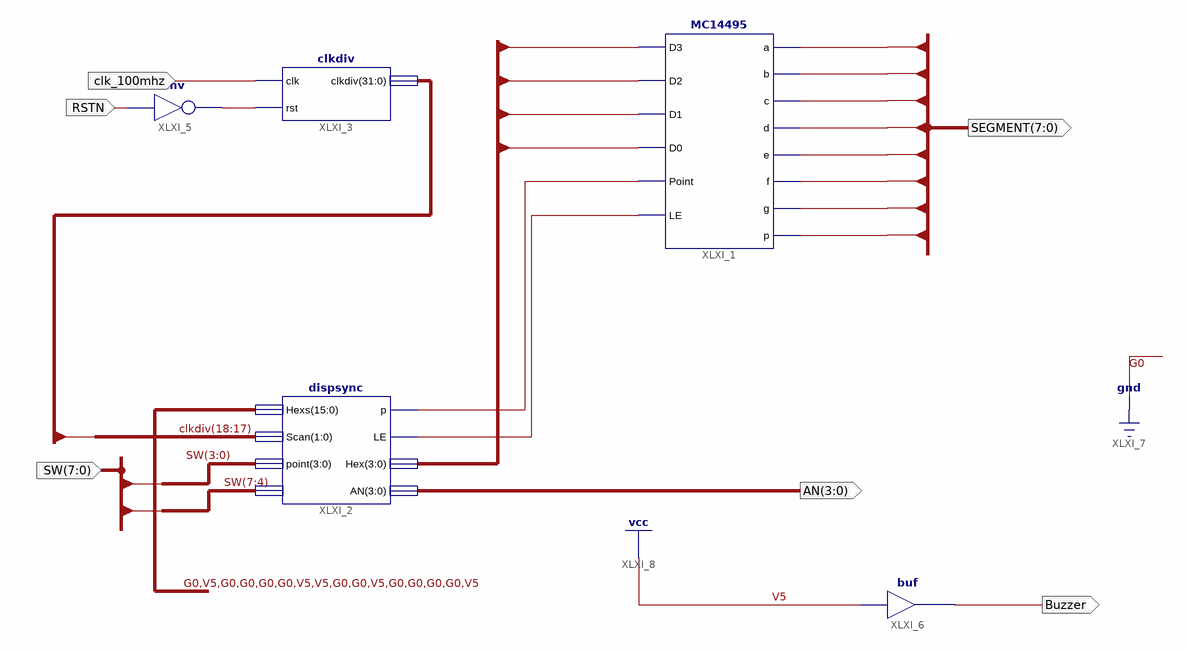
[diagram p0: schematic sheet 1]
// Xilinx ISE schematic Hex427Seg_sch.sch (kintex7) as structural Verilog: 5 symbols, 6 ports
module Hex427Seg_sch (
  input  [7:0] SW,
  input  clk_100mhz,
  input  RSTN,
  output [7:0] SEGMENT,
  output [3:0] AN,
  output Buzzer
);

  wire XLXN_20, XLXN_21, XLXN_24;
  wire [3:0] Hex;
  wire [31:0] clkdiv;

  MC14495 XLXI_1 (
    .D3(Hex[3]), .D2(Hex[2]), .D1(Hex[1]), .D0(Hex[0]), .Point(XLXN_20), .LE(XLXN_21), .a(SEGMENT[0]),
    .b(SEGMENT[1]), .c(SEGMENT[2]), .d(SEGMENT[3]), .e(SEGMENT[4]), .f(SEGMENT[5]), .g(SEGMENT[6]),
    .p(SEGMENT[7]));
  dispsync XLXI_2 (
    .Hexs(16'b0100001100100001), .Scan(clkdiv[18:17]), .point(SW[3:0]), .p(XLXN_20), .LE(XLXN_21), .Hex(Hex),
    .AN(AN));  // open: LES
  clkdiv XLXI_3 (.clk(clk_100mhz), .rst(XLXN_24), .clkdiv(clkdiv));
  not XLXI_5 (XLXN_24, RSTN);
  buf XLXI_6 (Buzzer, 1'b1);
endmodule
